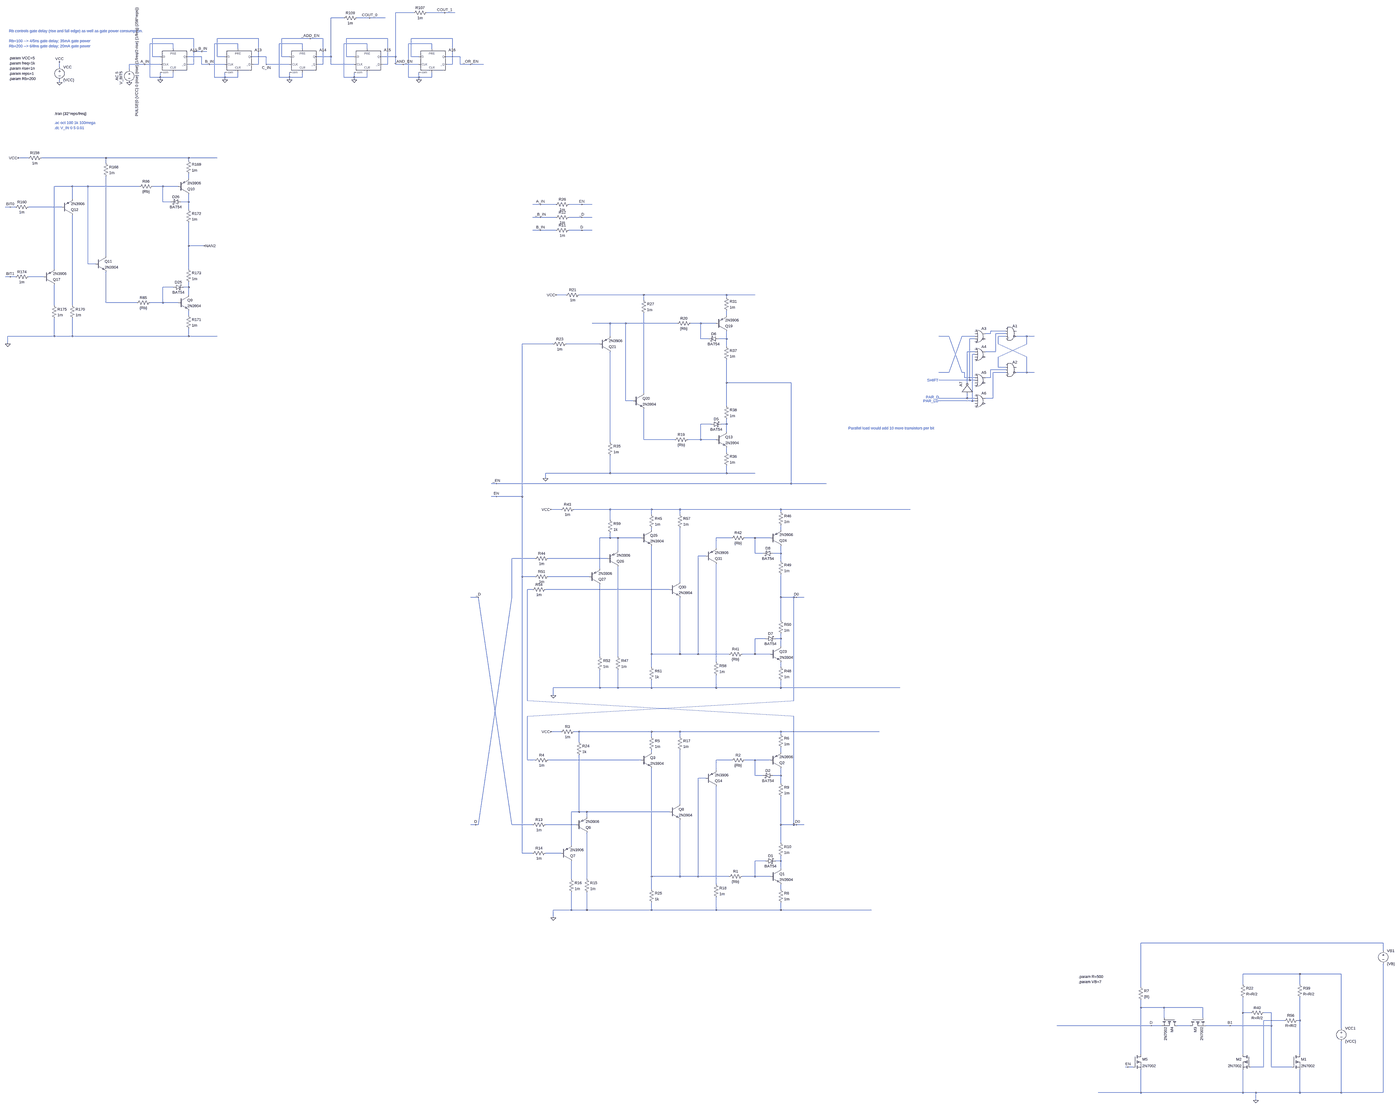
[diagram p0: schematic register_mos.asc, whole sheet]
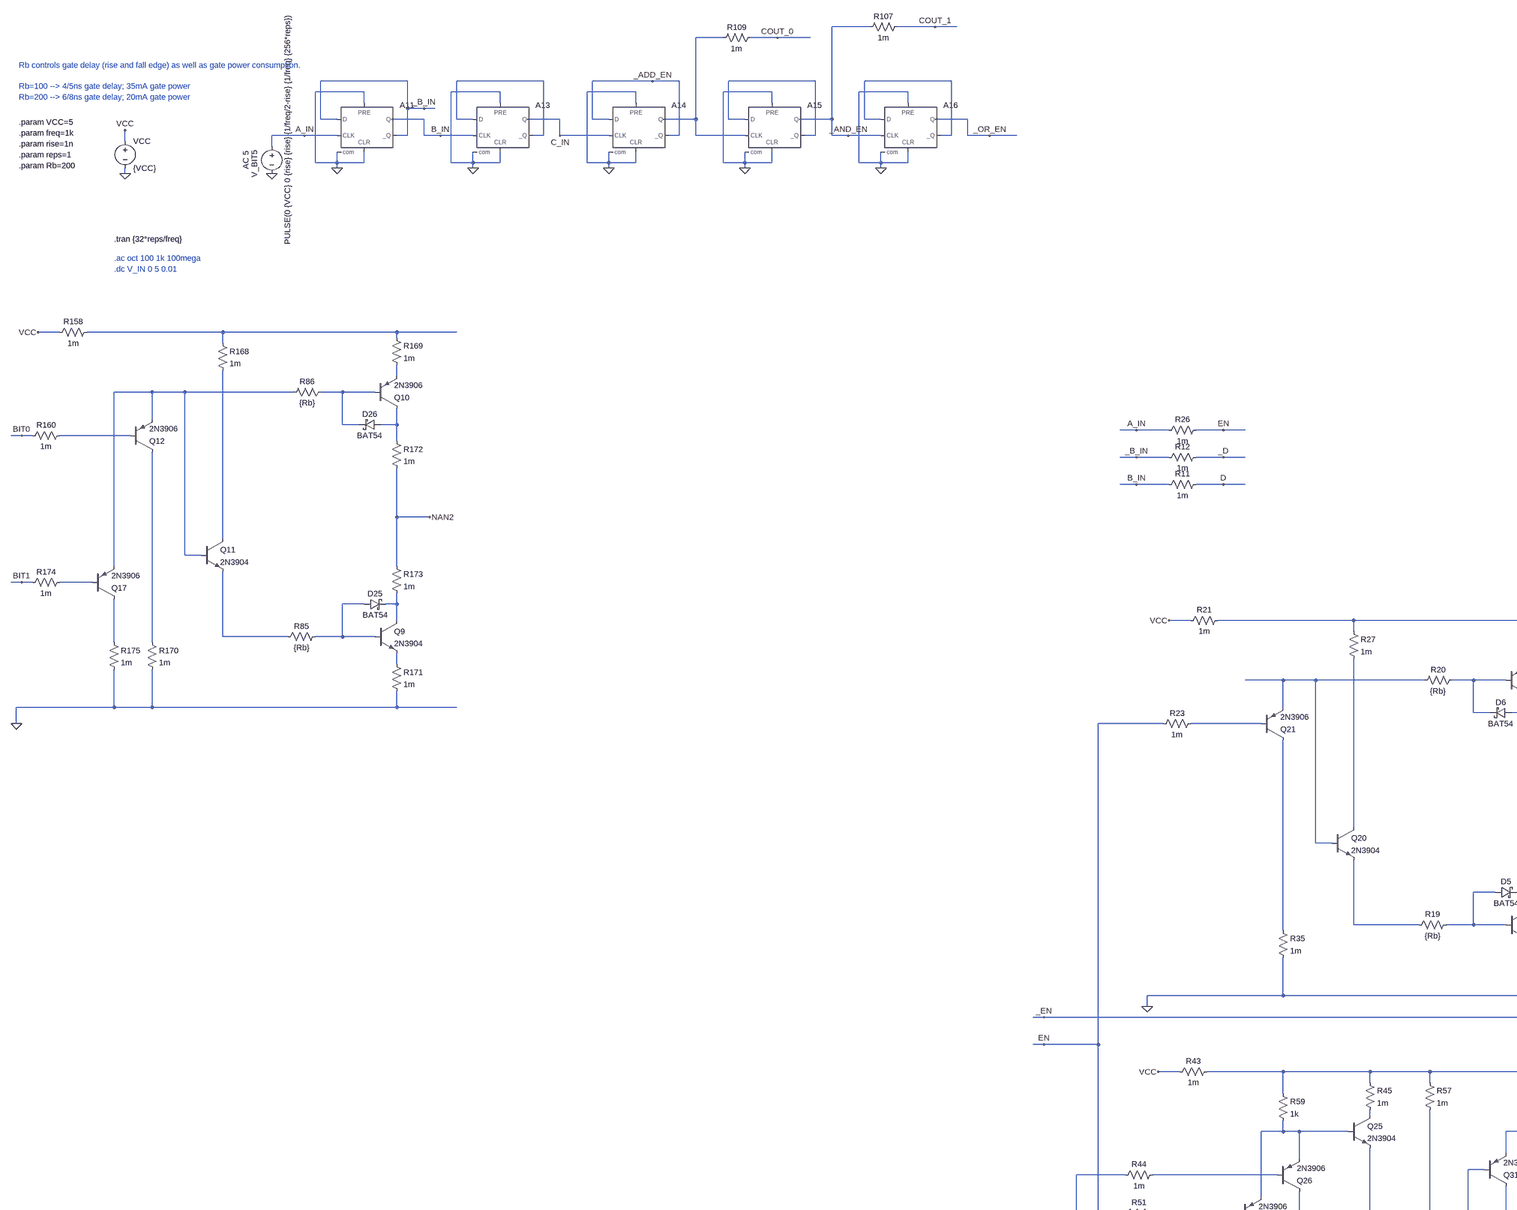
[diagram p1: schematic register_mos.asc, part, row 1 of 2, column 1 of 2]
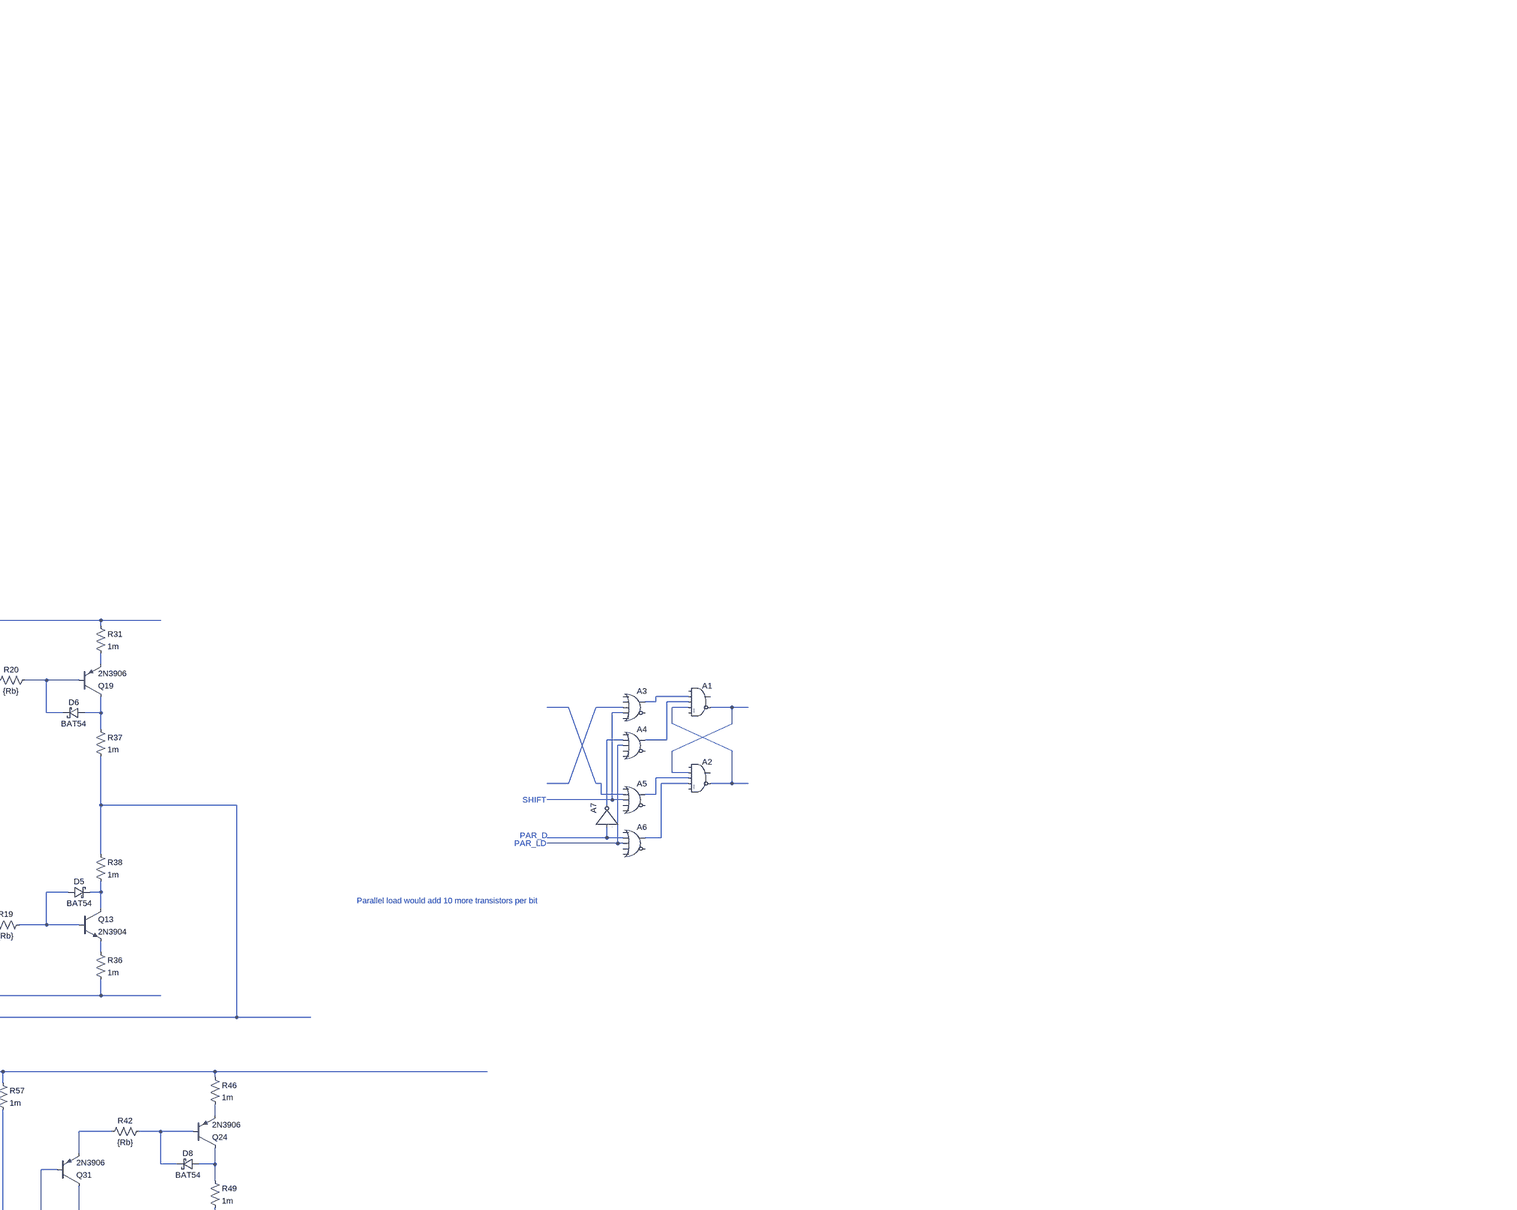
[diagram p2: schematic register_mos.asc, part, row 1 of 2, column 2 of 2]
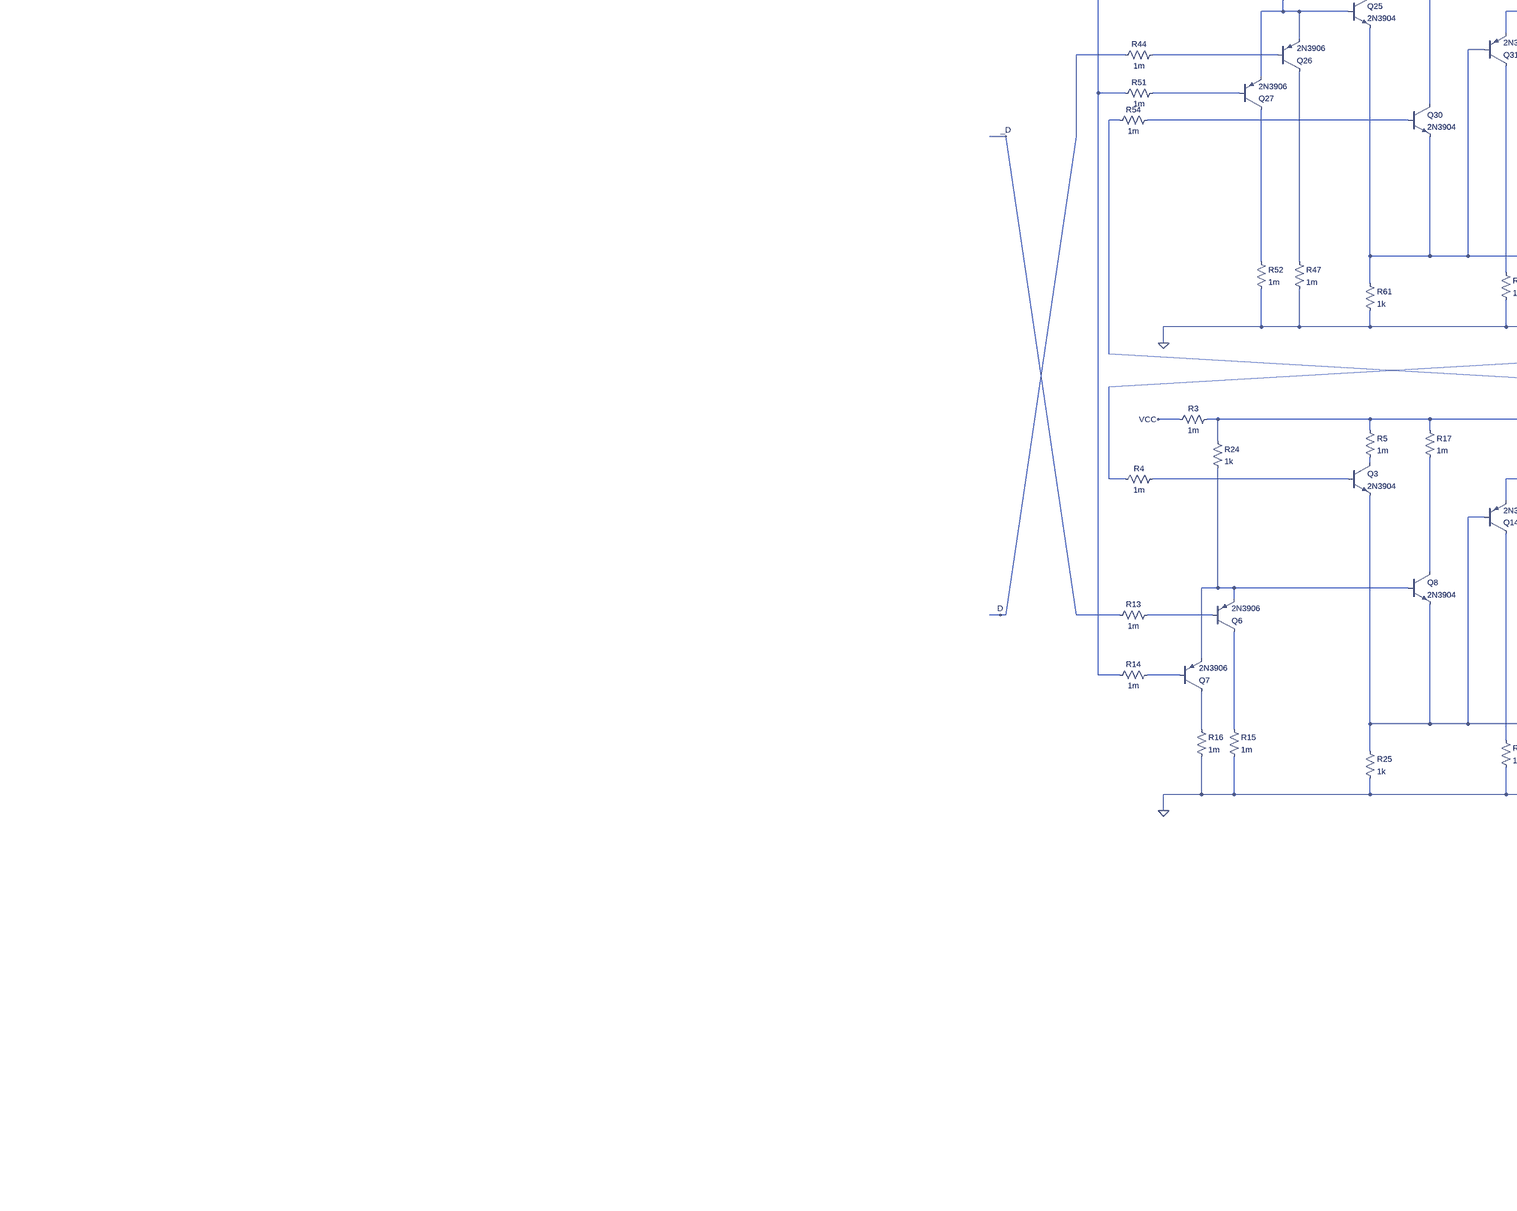
[diagram p3: schematic register_mos.asc, part, row 2 of 2, column 1 of 2]
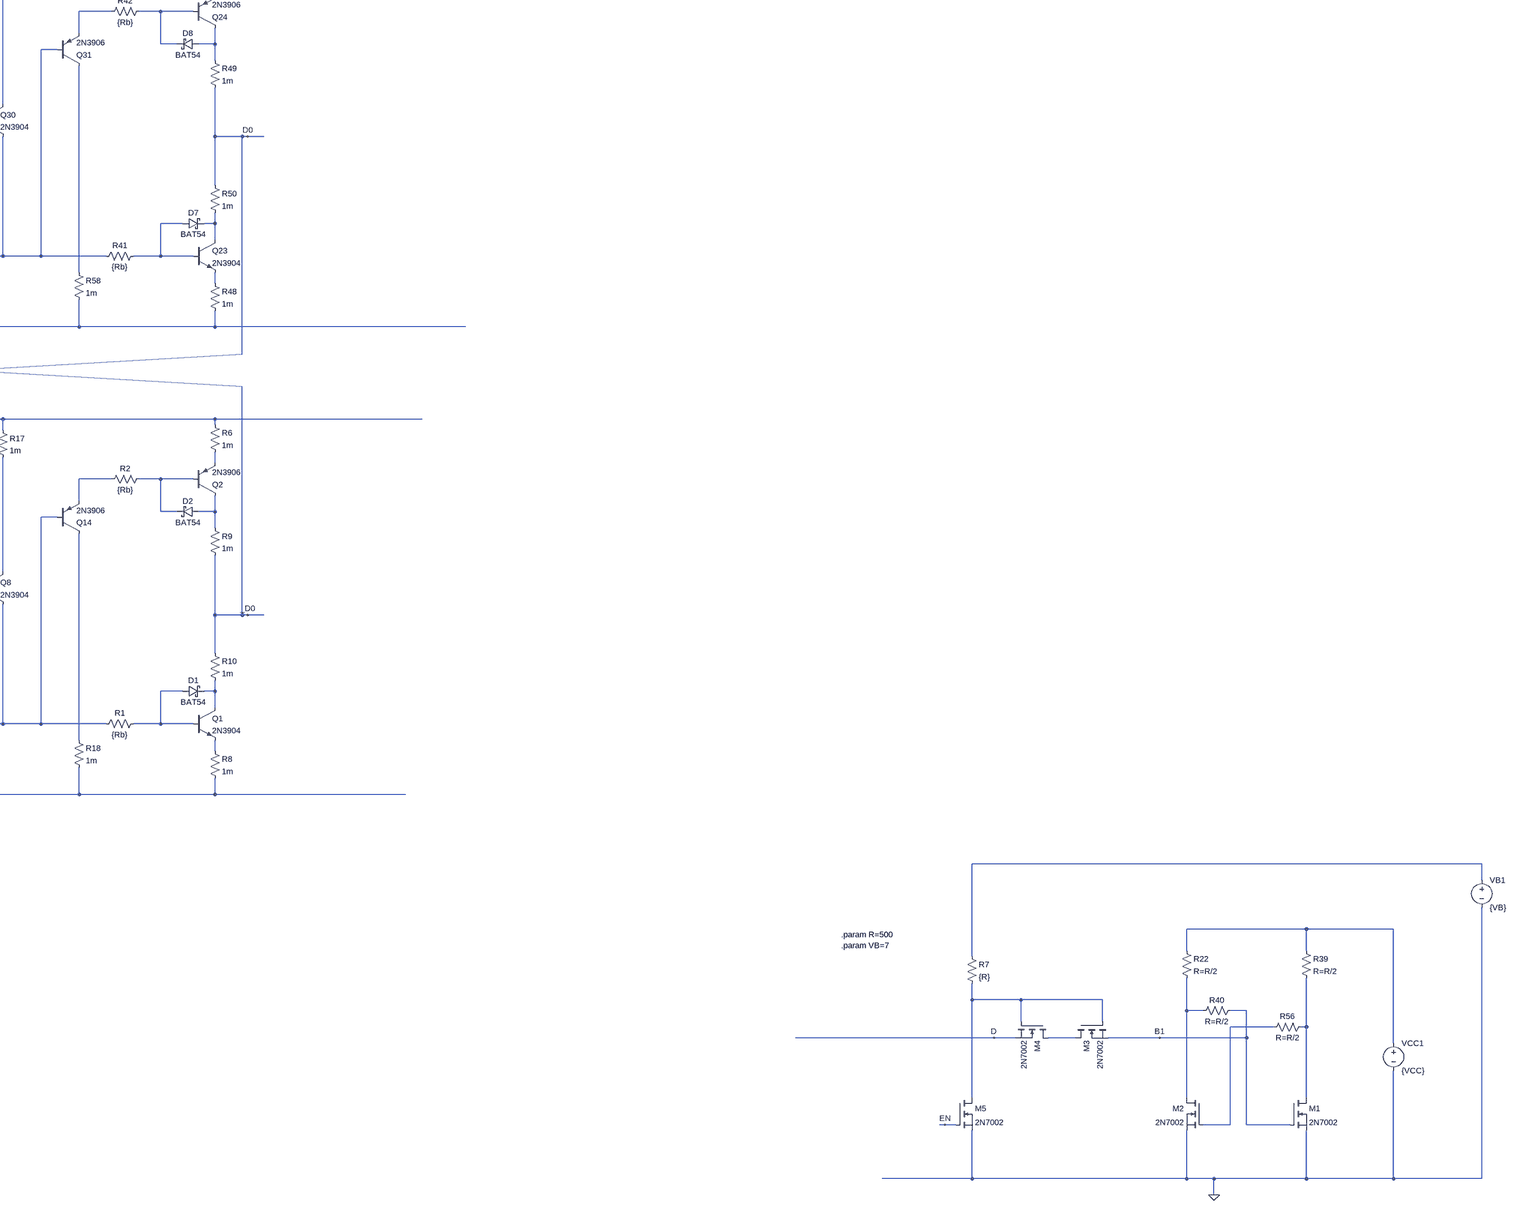
[diagram p4: schematic register_mos.asc, part, row 2 of 2, column 2 of 2]
register_mos.asc, the LTspice schematic file:
Version 4
SHEET 1 20052 9880
WIRE 1392 1344 1280 1344
WIRE 1584 1344 1472 1344
WIRE 1648 1344 1584 1344
WIRE 960 1376 880 1376
WIRE 1120 1376 1040 1376
WIRE 1216 1376 1120 1376
WIRE 32 1504 -224 1504
WIRE 432 1504 176 1504
WIRE 752 1504 576 1504
WIRE 832 1504 752 1504
WIRE 1232 1504 976 1504
WIRE 1632 1504 1376 1504
WIRE -96 1536 -240 1536
WIRE 304 1536 160 1536
WIRE 704 1536 560 1536
WIRE 1104 1536 960 1536
WIRE 1504 1536 1360 1536
WIRE -96 1568 -96 1536
WIRE 304 1568 304 1536
WIRE 704 1568 704 1536
WIRE 1104 1568 1104 1536
WIRE 1504 1568 1504 1536
WIRE 32 1584 32 1504
WIRE 80 1584 32 1584
WIRE 112 1584 80 1584
WIRE -224 1616 -224 1504
WIRE -176 1616 -224 1616
WIRE 80 1616 -16 1616
WIRE 176 1616 176 1504
WIRE 224 1616 176 1616
WIRE 480 1616 384 1616
WIRE 576 1616 576 1504
WIRE 624 1616 576 1616
WIRE 880 1616 880 1376
WIRE 880 1616 784 1616
WIRE 976 1616 976 1504
WIRE 1024 1616 976 1616
WIRE 1280 1616 1280 1344
WIRE 1280 1616 1184 1616
WIRE 1376 1616 1376 1504
WIRE 1424 1616 1376 1616
WIRE 1680 1616 1584 1616
WIRE -272 1664 -368 1664
WIRE -176 1664 -272 1664
WIRE 32 1664 32 1584
WIRE 32 1664 0 1664
WIRE 80 1664 80 1616
WIRE 128 1664 80 1664
WIRE 224 1664 128 1664
WIRE 432 1664 432 1504
WIRE 432 1664 400 1664
WIRE 480 1664 480 1616
WIRE 624 1664 480 1664
WIRE 832 1664 832 1504
WIRE 832 1664 800 1664
WIRE 880 1664 880 1616
WIRE 1024 1664 880 1664
WIRE 1232 1664 1232 1504
WIRE 1232 1664 1200 1664
WIRE 1280 1664 1280 1616
WIRE 1328 1664 1280 1664
WIRE 1424 1664 1328 1664
WIRE 1632 1664 1632 1504
WIRE 1632 1664 1600 1664
WIRE 1680 1664 1680 1616
WIRE 1744 1664 1680 1664
WIRE 1824 1664 1744 1664
WIRE -800 1680 -800 1648
WIRE -368 1696 -368 1664
WIRE -240 1744 -240 1536
WIRE -176 1744 -176 1712
WIRE -176 1744 -240 1744
WIRE -96 1744 -96 1712
WIRE -96 1744 -176 1744
WIRE 160 1744 160 1536
WIRE 224 1744 224 1712
WIRE 224 1744 160 1744
WIRE 304 1744 304 1712
WIRE 304 1744 224 1744
WIRE 560 1744 560 1536
WIRE 624 1744 624 1712
WIRE 624 1744 560 1744
WIRE 704 1744 704 1712
WIRE 704 1744 624 1744
WIRE 960 1744 960 1536
WIRE 1024 1744 1024 1712
WIRE 1024 1744 960 1744
WIRE 1104 1744 1104 1712
WIRE 1104 1744 1024 1744
WIRE 1360 1744 1360 1536
WIRE 1424 1744 1424 1712
WIRE 1424 1744 1360 1744
WIRE 1504 1744 1504 1712
WIRE 1504 1744 1424 1744
WIRE -176 1760 -176 1744
WIRE 224 1760 224 1744
WIRE 624 1760 624 1744
WIRE 1024 1760 1024 1744
WIRE 1424 1760 1424 1744
WIRE -800 1776 -800 1760
WIRE -992 2320 -1056 2320
WIRE -512 2320 -912 2320
WIRE 0 2320 -512 2320
WIRE 176 2320 0 2320
WIRE 0 2336 0 2320
WIRE -512 2352 -512 2320
WIRE 0 2448 0 2416
WIRE -720 2496 -832 2496
WIRE -624 2496 -720 2496
WIRE -304 2496 -624 2496
WIRE -160 2496 -224 2496
WIRE -64 2496 -160 2496
WIRE -720 2576 -720 2496
WIRE -160 2592 -160 2496
WIRE -112 2592 -160 2592
WIRE 0 2592 0 2544
WIRE 0 2592 -48 2592
WIRE 2176 2608 2128 2608
WIRE 2272 2608 2176 2608
WIRE 2432 2608 2352 2608
WIRE 2496 2608 2432 2608
WIRE -1104 2624 -1136 2624
WIRE -1072 2624 -1104 2624
WIRE -784 2624 -992 2624
WIRE 0 2640 0 2592
WIRE 2176 2688 2128 2688
WIRE 2272 2688 2176 2688
WIRE 2432 2688 2352 2688
WIRE 2496 2688 2432 2688
WIRE 2176 2768 2128 2768
WIRE 2272 2768 2176 2768
WIRE 2432 2768 2352 2768
WIRE 2496 2768 2432 2768
WIRE 0 2864 0 2720
WIRE 96 2864 0 2864
WIRE -512 2928 -512 2432
WIRE -624 2976 -624 2496
WIRE -576 2976 -624 2976
WIRE -832 3008 -832 2496
WIRE 0 3008 0 2864
WIRE -1104 3056 -1136 3056
WIRE -1072 3056 -1104 3056
WIRE -896 3056 -992 3056
WIRE -96 3120 -160 3120
WIRE 0 3120 0 3088
WIRE 0 3120 -32 3120
WIRE 0 3168 0 3120
WIRE 2336 3168 2272 3168
WIRE 2816 3168 2416 3168
WIRE 3328 3168 2816 3168
WIRE 3504 3168 3328 3168
WIRE 3328 3184 3328 3168
WIRE 2816 3200 2816 3168
WIRE -512 3216 -512 3024
WIRE -320 3216 -512 3216
WIRE -160 3216 -160 3120
WIRE -160 3216 -240 3216
WIRE -64 3216 -160 3216
WIRE -832 3232 -832 3104
WIRE -720 3232 -720 2672
WIRE 0 3296 0 3264
WIRE 3328 3296 3328 3264
WIRE 2608 3344 2496 3344
WIRE 2704 3344 2608 3344
WIRE 3024 3344 2704 3344
WIRE 3168 3344 3104 3344
WIRE 3264 3344 3168 3344
WIRE 5216 3392 5120 3392
WIRE 5120 3408 5120 3392
WIRE 5120 3408 5088 3408
WIRE 5216 3408 5152 3408
WIRE -832 3424 -832 3312
WIRE -832 3424 -1120 3424
WIRE -720 3424 -720 3312
WIRE -720 3424 -832 3424
WIRE 0 3424 0 3376
WIRE 0 3424 -720 3424
WIRE 176 3424 0 3424
WIRE 2608 3424 2608 3344
WIRE 4864 3424 4800 3424
WIRE 5024 3424 4944 3424
WIRE 5216 3424 5168 3424
WIRE 5344 3424 5280 3424
WIRE 5392 3424 5344 3424
WIRE 3168 3440 3168 3344
WIRE 3216 3440 3168 3440
WIRE 3328 3440 3328 3392
WIRE 3328 3440 3280 3440
WIRE 5024 3440 4992 3440
WIRE -1120 3472 -1120 3424
WIRE 2256 3472 2064 3472
WIRE 2544 3472 2336 3472
WIRE 5168 3472 5168 3424
WIRE 5344 3472 5344 3424
WIRE 3328 3488 3328 3440
WIRE 5024 3520 4976 3520
WIRE 5152 3520 5152 3408
WIRE 5152 3520 5088 3520
WIRE 5024 3536 5008 3536
WIRE 5168 3552 5344 3472
WIRE 5344 3552 5168 3472
WIRE 5168 3616 5168 3552
WIRE 5216 3616 5168 3616
WIRE 5216 3632 5120 3632
WIRE 4864 3648 4944 3424
WIRE 4864 3648 4800 3648
WIRE 4944 3648 4864 3424
WIRE 4960 3648 4944 3648
WIRE 5216 3648 5136 3648
WIRE 5344 3648 5344 3552
WIRE 5344 3648 5280 3648
WIRE 5392 3648 5344 3648
WIRE 4960 3680 4960 3648
WIRE 5024 3680 4960 3680
WIRE 5120 3680 5120 3632
WIRE 5120 3680 5088 3680
WIRE 4992 3696 4992 3440
WIRE 4992 3696 4800 3696
WIRE 5024 3696 4992 3696
WIRE 3328 3712 3328 3568
WIRE 3728 3712 3328 3712
WIRE 4976 3712 4976 3520
WIRE 2816 3776 2816 3280
WIRE 4976 3808 4976 3776
WIRE 4976 3808 4800 3808
WIRE 5024 3808 4976 3808
WIRE 5136 3808 5136 3648
WIRE 5136 3808 5088 3808
WIRE 2704 3824 2704 3344
WIRE 2752 3824 2704 3824
WIRE 5008 3824 5008 3536
WIRE 5008 3824 4800 3824
WIRE 5024 3824 5008 3824
WIRE 3328 3856 3328 3712
WIRE 3232 3968 3168 3968
WIRE 3328 3968 3328 3936
WIRE 3328 3968 3296 3968
WIRE 3328 4016 3328 3968
WIRE 2816 4064 2816 3872
WIRE 3008 4064 2816 4064
WIRE 3168 4064 3168 3968
WIRE 3168 4064 3088 4064
WIRE 3264 4064 3168 4064
WIRE 2608 4080 2608 3520
WIRE 3328 4144 3328 4112
WIRE 2608 4272 2608 4160
WIRE 2608 4272 2208 4272
WIRE 3328 4272 3328 4224
WIRE 3328 4272 2608 4272
WIRE 3504 4272 3328 4272
WIRE 2208 4304 2208 4272
WIRE 1904 4336 1872 4336
WIRE 3728 4336 3728 3712
WIRE 3728 4336 1904 4336
WIRE 4080 4336 3728 4336
WIRE 1904 4416 1872 4416
WIRE 2064 4416 2064 3472
WIRE 2064 4416 1904 4416
WIRE 2304 4496 2240 4496
WIRE 2608 4496 2384 4496
WIRE 2864 4496 2608 4496
WIRE 3040 4496 2864 4496
WIRE 3664 4496 3040 4496
WIRE 4624 4496 3664 4496
WIRE 3664 4512 3664 4496
WIRE 2864 4528 2864 4496
WIRE 3040 4528 3040 4496
WIRE 2608 4560 2608 4496
WIRE 2864 4624 2864 4608
WIRE 3664 4624 3664 4592
WIRE 2608 4672 2608 4640
WIRE 2608 4672 2544 4672
WIRE 2656 4672 2608 4672
WIRE 2800 4672 2656 4672
WIRE 3360 4672 3264 4672
WIRE 3504 4672 3440 4672
WIRE 3600 4672 3504 4672
WIRE 3264 4736 3264 4672
WIRE 2656 4752 2656 4672
WIRE 3504 4768 3504 4672
WIRE 3552 4768 3504 4768
WIRE 3664 4768 3664 4720
WIRE 3664 4768 3616 4768
WIRE 3200 4784 3152 4784
WIRE 2144 4800 2000 4800
WIRE 2592 4800 2224 4800
WIRE 3664 4816 3664 4768
WIRE 2544 4864 2544 4672
WIRE 2064 4912 2064 4416
WIRE 2144 4912 2064 4912
WIRE 2480 4912 2224 4912
WIRE 3040 4944 3040 4608
WIRE 2128 4992 2096 4992
WIRE 2976 4992 2208 4992
WIRE 1792 5040 1744 5040
WIRE 2000 5040 2000 4800
WIRE 3664 5040 3664 4896
WIRE 3744 5040 3664 5040
WIRE 3760 5040 3744 5040
WIRE 3808 5040 3760 5040
WIRE 3664 5184 3664 5040
WIRE 3568 5296 3504 5296
WIRE 3664 5296 3664 5264
WIRE 3664 5296 3632 5296
WIRE 3664 5344 3664 5296
WIRE 2864 5392 2864 4720
WIRE 3040 5392 3040 5040
WIRE 3040 5392 2864 5392
WIRE 3152 5392 3152 4784
WIRE 3152 5392 3040 5392
WIRE 3344 5392 3152 5392
WIRE 3504 5392 3504 5296
WIRE 3504 5392 3424 5392
WIRE 3600 5392 3504 5392
WIRE 2544 5408 2544 4960
WIRE 2656 5408 2656 4848
WIRE 3264 5440 3264 4832
WIRE 2864 5472 2864 5392
WIRE 3664 5472 3664 5440
WIRE 2544 5600 2544 5488
WIRE 2544 5600 2256 5600
WIRE 2656 5600 2656 5488
WIRE 2656 5600 2544 5600
WIRE 2864 5600 2864 5552
WIRE 2864 5600 2656 5600
WIRE 3264 5600 3264 5520
WIRE 3264 5600 2864 5600
WIRE 3664 5600 3664 5552
WIRE 3664 5600 3264 5600
WIRE 4560 5600 3664 5600
WIRE 2256 5648 2256 5600
WIRE 2096 5680 2096 4992
WIRE 3744 5680 3744 5040
WIRE 2096 5776 3744 5680
WIRE 3744 5776 2096 5680
WIRE 2304 5872 2240 5872
WIRE 2416 5872 2384 5872
WIRE 2864 5872 2416 5872
WIRE 3040 5872 2864 5872
WIRE 3664 5872 3040 5872
WIRE 4432 5872 3664 5872
WIRE 3664 5888 3664 5872
WIRE 2864 5904 2864 5872
WIRE 3040 5904 3040 5872
WIRE 2416 5936 2416 5872
WIRE 2864 6000 2864 5984
WIRE 3664 6000 3664 5968
WIRE 2096 6048 2096 5776
WIRE 2144 6048 2096 6048
WIRE 2800 6048 2224 6048
WIRE 3360 6048 3264 6048
WIRE 3504 6048 3440 6048
WIRE 3600 6048 3504 6048
WIRE 3264 6112 3264 6048
WIRE 3504 6144 3504 6048
WIRE 3552 6144 3504 6144
WIRE 3664 6144 3664 6096
WIRE 3664 6144 3616 6144
WIRE 3200 6160 3152 6160
WIRE 3664 6192 3664 6144
WIRE 3040 6320 3040 5984
WIRE 2416 6368 2416 6016
WIRE 2416 6368 2368 6368
WIRE 2464 6368 2416 6368
WIRE 2976 6368 2464 6368
WIRE 2464 6400 2464 6368
WIRE 1776 6448 1744 6448
WIRE 1792 6448 2000 5040
WIRE 1792 6448 1776 6448
WIRE 2000 6448 1792 5040
WIRE 2128 6448 2000 6448
WIRE 2400 6448 2208 6448
WIRE 3664 6448 3664 6272
WIRE 3744 6448 3744 5776
WIRE 3744 6448 3664 6448
WIRE 3760 6448 3744 6448
WIRE 3808 6448 3760 6448
WIRE 3664 6560 3664 6448
WIRE 2368 6576 2368 6368
WIRE 2064 6624 2064 4912
WIRE 2128 6624 2064 6624
WIRE 2304 6624 2208 6624
WIRE 3568 6672 3504 6672
WIRE 3664 6672 3664 6640
WIRE 3664 6672 3632 6672
WIRE 3664 6720 3664 6672
WIRE 2864 6768 2864 6096
WIRE 3040 6768 3040 6416
WIRE 3040 6768 2864 6768
WIRE 3152 6768 3152 6160
WIRE 3152 6768 3040 6768
WIRE 3344 6768 3152 6768
WIRE 3504 6768 3504 6672
WIRE 3504 6768 3424 6768
WIRE 3600 6768 3504 6768
WIRE 2368 6784 2368 6672
WIRE 2464 6784 2464 6496
WIRE 3264 6816 3264 6208
WIRE 2864 6848 2864 6768
WIRE 3664 6848 3664 6816
WIRE 2368 6976 2368 6864
WIRE 2368 6976 2256 6976
WIRE 2464 6976 2464 6864
WIRE 2464 6976 2368 6976
WIRE 2864 6976 2864 6928
WIRE 2864 6976 2464 6976
WIRE 3264 6976 3264 6896
WIRE 3264 6976 2864 6976
WIRE 3664 6976 3664 6928
WIRE 3664 6976 3264 6976
WIRE 4384 6976 3664 6976
WIRE 2256 7024 2256 6976
WIRE 7760 8784 6192 8784
WIRE 7760 8832 7760 8784
WIRE 7200 8976 6848 8976
WIRE 7456 8976 7200 8976
WIRE 6848 9040 6848 8976
WIRE 7200 9040 7200 8976
WIRE 6192 9056 6192 8784
WIRE 6192 9184 6192 9136
WIRE 6336 9184 6192 9184
WIRE 6576 9184 6336 9184
WIRE 6848 9216 6848 9120
WIRE 6896 9216 6848 9216
WIRE 7024 9216 6976 9216
WIRE 6336 9248 6336 9184
WIRE 6576 9248 6576 9184
WIRE 7104 9264 6976 9264
WIRE 7200 9264 7200 9120
WIRE 7200 9264 7184 9264
WIRE 6256 9296 5632 9296
WIRE 6320 9296 6256 9296
WIRE 6496 9296 6416 9296
WIRE 6768 9296 6592 9296
WIRE 7024 9296 7024 9216
WIRE 7024 9296 6768 9296
WIRE 7456 9312 7456 8976
WIRE 6192 9472 6192 9184
WIRE 6848 9472 6848 9216
WIRE 7200 9472 7200 9264
WIRE 6112 9552 6096 9552
WIRE 6144 9552 6112 9552
WIRE 6976 9552 6976 9264
WIRE 6976 9552 6896 9552
WIRE 7024 9552 7024 9296
WIRE 7152 9552 7024 9552
WIRE 6192 9792 6192 9568
WIRE 6192 9792 5920 9792
WIRE 6848 9792 6848 9568
WIRE 6848 9792 6192 9792
WIRE 6928 9792 6848 9792
WIRE 7200 9792 7200 9568
WIRE 7200 9792 6928 9792
WIRE 7456 9792 7456 9392
WIRE 7456 9792 7200 9792
WIRE 7760 9792 7760 8912
WIRE 7760 9792 7456 9792
WIRE 6928 9840 6928 9792
FLAG -800 1776 0
FLAG -800 1648 VCC
FLAG -1120 3472 0
FLAG 96 2864 NAN2
FLAG -1104 2624 BIT0
FLAG -1056 2320 VCC
FLAG -1104 3056 BIT1
FLAG -176 1760 0
FLAG -368 1776 0
FLAG -272 1664 A_IN
FLAG 128 1664 B_IN
FLAG 224 1760 0
FLAG 480 1664 C_IN
FLAG 624 1760 0
FLAG 752 1504 _ADD_EN
FLAG 1024 1760 0
FLAG 1328 1664 _AND_EN
FLAG 1424 1760 0
FLAG 1744 1664 _OR_EN
FLAG 1120 1376 COUT_0
FLAG 1584 1344 COUT_1
FLAG 2208 4304 0
FLAG 1904 4336 _EN
FLAG 1904 4416 EN
FLAG 2272 3168 VCC
FLAG 2256 5648 0
FLAG 3760 5040 D0
FLAG 2240 4496 VCC
FLAG 2256 7024 0
FLAG 3760 6448 _D0
FLAG 2240 5872 VCC
FLAG 1792 5040 _D
FLAG 1776 6448 D
FLAG 80 1584 _B_IN
FLAG 2432 2608 EN
FLAG 2432 2688 _D
FLAG 2432 2768 D
FLAG 2176 2608 A_IN
FLAG 2176 2688 _B_IN
FLAG 2176 2768 B_IN
FLAG 6928 9840 0
FLAG 6768 9296 B1
FLAG 6256 9296 D
FLAG 6112 9552 EN
SYMBOL voltage -800 1664 R0
WINDOW 123 0 0 Left 0
WINDOW 39 0 0 Left 0
SYMATTR InstName VCC
SYMATTR Value {VCC}
SYMBOL res -336 3232 R270
WINDOW 0 32 56 VTop 2
WINDOW 3 0 56 VBottom 2
SYMATTR InstName R85
SYMATTR Value {Rb}
SYMBOL npn -64 3168 R0
SYMATTR InstName Q9
SYMATTR Value 2N3904
SYMBOL schottky -96 3136 R270
WINDOW 0 32 32 VTop 2
WINDOW 3 0 32 VBottom 2
SYMATTR InstName D25
SYMATTR Value BAT54
SYMATTR Description Diode
SYMATTR Type diode
SYMBOL pnp -64 2544 M180
SYMATTR InstName Q10
SYMATTR Value 2N3906
SYMBOL schottky -48 2576 R90
WINDOW 0 0 32 VBottom 2
WINDOW 3 32 32 VTop 2
SYMATTR InstName D26
SYMATTR Value BAT54
SYMATTR Description Diode
SYMATTR Type diode
SYMBOL res -208 2480 R90
WINDOW 0 0 56 VBottom 2
WINDOW 3 32 56 VTop 2
SYMATTR InstName R86
SYMATTR Value {Rb}
SYMBOL res -1008 2336 R270
WINDOW 0 32 56 VTop 2
WINDOW 3 0 56 VBottom 2
SYMATTR InstName R158
SYMATTR Value 1m
SYMBOL res -1088 2640 R270
WINDOW 0 32 56 VTop 2
WINDOW 3 0 56 VBottom 2
SYMATTR InstName R160
SYMATTR Value 1m
SYMBOL npn -576 2928 R0
SYMATTR InstName Q11
SYMATTR Value 2N3904
SYMBOL pnp -784 2672 M180
SYMATTR InstName Q12
SYMATTR Value 2N3906
SYMBOL res -528 2336 R0
SYMATTR InstName R168
SYMATTR Value 1m
SYMBOL res -16 2320 R0
SYMATTR InstName R169
SYMATTR Value 1m
SYMBOL res -736 3216 R0
SYMATTR InstName R170
SYMATTR Value 1m
SYMBOL res -16 3280 R0
SYMATTR InstName R171
SYMATTR Value 1m
SYMBOL res -16 2624 R0
SYMATTR InstName R172
SYMATTR Value 1m
SYMBOL res -16 2992 R0
SYMATTR InstName R173
SYMATTR Value 1m
SYMBOL pnp -896 3104 M180
SYMATTR InstName Q17
SYMATTR Value 2N3906
SYMBOL res -1088 3072 R270
WINDOW 0 32 56 VTop 2
WINDOW 3 0 56 VBottom 2
SYMATTR InstName R174
SYMATTR Value 1m
SYMBOL res -848 3216 R0
SYMATTR InstName R175
SYMATTR Value 1m
SYMBOL voltage -368 1680 R0
WINDOW 123 -77 30 VRight 2
WINDOW 39 0 0 Left 0
WINDOW 0 -51 28 VRight 2
WINDOW 3 46 -379 VRight 2
SYMATTR Value2 AC 5
SYMATTR InstName V_BIT5
SYMATTR Value PULSE(0 {VCC} 0 {rise} {rise} {1/freq/2-rise} {1/freq} {256*reps})
SYMBOL Digital\\dflop -96 1568 R0
SYMATTR SpiceLine Vhigh={VCC}
SYMATTR InstName A11
SYMBOL Digital\\dflop 304 1568 R0
SYMATTR SpiceLine Vhigh={VCC}
SYMATTR InstName A13
SYMBOL Digital\\dflop 1104 1568 R0
SYMATTR SpiceLine Vhigh={VCC}
SYMATTR InstName A15
SYMBOL Digital\\dflop 1504 1568 R0
SYMATTR SpiceLine Vhigh={VCC}
SYMATTR InstName A16
SYMBOL Digital\\dflop 704 1568 R0
SYMATTR SpiceLine Vhigh={VCC}
SYMATTR InstName A14
SYMBOL res 1488 1328 R90
WINDOW 0 0 56 VBottom 2
WINDOW 3 32 56 VTop 2
SYMATTR InstName R107
SYMATTR Value 1m
SYMBOL res 1056 1360 R90
WINDOW 0 0 56 VBottom 2
WINDOW 3 32 56 VTop 2
SYMATTR InstName R109
SYMATTR Value 1m
SYMBOL res 2992 4080 R270
WINDOW 0 32 56 VTop 2
WINDOW 3 0 56 VBottom 2
SYMATTR InstName R19
SYMATTR Value {Rb}
SYMBOL npn 3264 4016 R0
SYMATTR InstName Q13
SYMATTR Value 2N3904
SYMBOL schottky 3232 3984 R270
WINDOW 0 32 32 VTop 2
WINDOW 3 0 32 VBottom 2
SYMATTR InstName D5
SYMATTR Value BAT54
SYMATTR Description Diode
SYMATTR Type diode
SYMBOL pnp 3264 3392 M180
SYMATTR InstName Q19
SYMATTR Value 2N3906
SYMBOL schottky 3280 3424 R90
WINDOW 0 0 32 VBottom 2
WINDOW 3 32 32 VTop 2
SYMATTR InstName D6
SYMATTR Value BAT54
SYMATTR Description Diode
SYMATTR Type diode
SYMBOL res 3120 3328 R90
WINDOW 0 0 56 VBottom 2
WINDOW 3 32 56 VTop 2
SYMATTR InstName R20
SYMATTR Value {Rb}
SYMBOL res 2320 3184 R270
WINDOW 0 32 56 VTop 2
WINDOW 3 0 56 VBottom 2
SYMATTR InstName R21
SYMATTR Value 1m
SYMBOL res 2240 3488 R270
WINDOW 0 32 56 VTop 2
WINDOW 3 0 56 VBottom 2
SYMATTR InstName R23
SYMATTR Value 1m
SYMBOL npn 2752 3776 R0
SYMATTR InstName Q20
SYMATTR Value 2N3904
SYMBOL pnp 2544 3520 M180
SYMATTR InstName Q21
SYMATTR Value 2N3906
SYMBOL res 2800 3184 R0
SYMATTR InstName R27
SYMATTR Value 1m
SYMBOL res 3312 3168 R0
SYMATTR InstName R31
SYMATTR Value 1m
SYMBOL res 2592 4064 R0
SYMATTR InstName R35
SYMATTR Value 1m
SYMBOL res 3312 4128 R0
SYMATTR InstName R36
SYMATTR Value 1m
SYMBOL res 3312 3472 R0
SYMATTR InstName R37
SYMATTR Value 1m
SYMBOL res 3312 3840 R0
SYMATTR InstName R38
SYMATTR Value 1m
SYMBOL res 3328 5408 R270
WINDOW 0 32 56 VTop 2
WINDOW 3 0 56 VBottom 2
SYMATTR InstName R41
SYMATTR Value {Rb}
SYMBOL npn 3600 5344 R0
SYMATTR InstName Q23
SYMATTR Value 2N3904
SYMBOL schottky 3568 5312 R270
WINDOW 0 32 32 VTop 2
WINDOW 3 0 32 VBottom 2
SYMATTR InstName D7
SYMATTR Value BAT54
SYMATTR Description Diode
SYMATTR Type diode
SYMBOL pnp 3600 4720 M180
SYMATTR InstName Q24
SYMATTR Value 2N3906
SYMBOL schottky 3616 4752 R90
WINDOW 0 0 32 VBottom 2
WINDOW 3 32 32 VTop 2
SYMATTR InstName D8
SYMATTR Value BAT54
SYMATTR Description Diode
SYMATTR Type diode
SYMBOL res 3456 4656 R90
WINDOW 0 0 56 VBottom 2
WINDOW 3 32 56 VTop 2
SYMATTR InstName R42
SYMATTR Value {Rb}
SYMBOL res 2288 4512 R270
WINDOW 0 32 56 VTop 2
WINDOW 3 0 56 VBottom 2
SYMATTR InstName R43
SYMATTR Value 1m
SYMBOL res 2128 4816 R270
WINDOW 0 32 56 VTop 2
WINDOW 3 0 56 VBottom 2
SYMATTR InstName R44
SYMATTR Value 1m
SYMBOL npn 2800 4624 R0
SYMATTR InstName Q25
SYMATTR Value 2N3904
SYMBOL pnp 2592 4848 M180
SYMATTR InstName Q26
SYMATTR Value 2N3906
SYMBOL res 2848 4512 R0
SYMATTR InstName R45
SYMATTR Value 1m
SYMBOL res 3648 4496 R0
SYMATTR InstName R46
SYMATTR Value 1m
SYMBOL res 2640 5392 R0
SYMATTR InstName R47
SYMATTR Value 1m
SYMBOL res 3648 5456 R0
SYMATTR InstName R48
SYMATTR Value 1m
SYMBOL res 3648 4800 R0
SYMATTR InstName R49
SYMATTR Value 1m
SYMBOL res 3648 5168 R0
SYMATTR InstName R50
SYMATTR Value 1m
SYMBOL pnp 2480 4960 M180
SYMATTR InstName Q27
SYMATTR Value 2N3906
SYMBOL res 2128 4928 R270
WINDOW 0 32 56 VTop 2
WINDOW 3 0 56 VBottom 2
SYMATTR InstName R51
SYMATTR Value 1m
SYMBOL res 2528 5392 R0
SYMATTR InstName R52
SYMATTR Value 1m
SYMBOL res 2112 5008 R270
WINDOW 0 32 56 VTop 2
WINDOW 3 0 56 VBottom 2
SYMATTR InstName R54
SYMATTR Value 1m
SYMBOL res 3024 4512 R0
SYMATTR InstName R57
SYMATTR Value 1m
SYMBOL npn 2976 4944 R0
SYMATTR InstName Q30
SYMATTR Value 2N3904
SYMBOL pnp 3200 4832 M180
SYMATTR InstName Q31
SYMATTR Value 2N3906
SYMBOL res 3248 5424 R0
SYMATTR InstName R58
SYMATTR Value 1m
SYMBOL res 2592 4544 R0
SYMATTR InstName R59
SYMATTR Value 1k
SYMBOL res 2848 5456 R0
SYMATTR InstName R61
SYMATTR Value 1k
SYMBOL res 3328 6784 R270
WINDOW 0 32 56 VTop 2
WINDOW 3 0 56 VBottom 2
SYMATTR InstName R1
SYMATTR Value {Rb}
SYMBOL npn 3600 6720 R0
SYMATTR InstName Q1
SYMATTR Value 2N3904
SYMBOL schottky 3568 6688 R270
WINDOW 0 32 32 VTop 2
WINDOW 3 0 32 VBottom 2
SYMATTR InstName D1
SYMATTR Value BAT54
SYMATTR Description Diode
SYMATTR Type diode
SYMBOL pnp 3600 6096 M180
SYMATTR InstName Q2
SYMATTR Value 2N3906
SYMBOL schottky 3616 6128 R90
WINDOW 0 0 32 VBottom 2
WINDOW 3 32 32 VTop 2
SYMATTR InstName D2
SYMATTR Value BAT54
SYMATTR Description Diode
SYMATTR Type diode
SYMBOL res 3456 6032 R90
WINDOW 0 0 56 VBottom 2
WINDOW 3 32 56 VTop 2
SYMATTR InstName R2
SYMATTR Value {Rb}
SYMBOL res 2288 5888 R270
WINDOW 0 32 56 VTop 2
WINDOW 3 0 56 VBottom 2
SYMATTR InstName R3
SYMATTR Value 1m
SYMBOL res 2128 6064 R270
WINDOW 0 32 56 VTop 2
WINDOW 3 0 56 VBottom 2
SYMATTR InstName R4
SYMATTR Value 1m
SYMBOL npn 2800 6000 R0
SYMATTR InstName Q3
SYMATTR Value 2N3904
SYMBOL res 2848 5888 R0
SYMATTR InstName R5
SYMATTR Value 1m
SYMBOL res 3648 5872 R0
SYMATTR InstName R6
SYMATTR Value 1m
SYMBOL res 3648 6832 R0
SYMATTR InstName R8
SYMATTR Value 1m
SYMBOL res 3648 6176 R0
SYMATTR InstName R9
SYMATTR Value 1m
SYMBOL res 3648 6544 R0
SYMATTR InstName R10
SYMATTR Value 1m
SYMBOL pnp 2400 6496 M180
SYMATTR InstName Q6
SYMATTR Value 2N3906
SYMBOL res 2112 6464 R270
WINDOW 0 32 56 VTop 2
WINDOW 3 0 56 VBottom 2
SYMATTR InstName R13
SYMATTR Value 1m
SYMBOL pnp 2304 6672 M180
SYMATTR InstName Q7
SYMATTR Value 2N3906
SYMBOL res 2112 6640 R270
WINDOW 0 32 56 VTop 2
WINDOW 3 0 56 VBottom 2
SYMATTR InstName R14
SYMATTR Value 1m
SYMBOL res 2448 6768 R0
SYMATTR InstName R15
SYMATTR Value 1m
SYMBOL res 2352 6768 R0
SYMATTR InstName R16
SYMATTR Value 1m
SYMBOL res 3024 5888 R0
SYMATTR InstName R17
SYMATTR Value 1m
SYMBOL npn 2976 6320 R0
SYMATTR InstName Q8
SYMATTR Value 2N3904
SYMBOL pnp 3200 6208 M180
SYMATTR InstName Q14
SYMATTR Value 2N3906
SYMBOL res 3248 6800 R0
SYMATTR InstName R18
SYMATTR Value 1m
SYMBOL res 2400 5920 R0
SYMATTR InstName R24
SYMATTR Value 1k
SYMBOL res 2848 6832 R0
SYMATTR InstName R25
SYMATTR Value 1k
SYMBOL res 2256 2784 R270
WINDOW 0 32 56 VTop 2
WINDOW 3 0 56 VBottom 2
SYMATTR InstName R11
SYMATTR Value 1m
SYMBOL res 2256 2704 R270
WINDOW 0 32 56 VTop 2
WINDOW 3 0 56 VBottom 2
SYMATTR InstName R12
SYMATTR Value 1m
SYMBOL res 2256 2624 R270
WINDOW 0 32 56 VTop 2
WINDOW 3 0 56 VBottom 2
SYMATTR InstName R26
SYMATTR Value 1m
SYMBOL Digital\\and 5248 3344 R0
SYMATTR InstName A1
SYMBOL Digital\\and 5248 3568 R0
SYMATTR InstName A2
SYMBOL Digital\\or 5056 3360 R0
SYMATTR InstName A3
SYMBOL Digital\\or 5056 3472 R0
SYMATTR InstName A4
SYMBOL Digital\\or 5056 3632 R0
SYMATTR InstName A5
SYMBOL Digital\\or 5056 3760 R0
SYMATTR InstName A6
SYMBOL Digital\\inv 4912 3776 R270
SYMATTR InstName A7
SYMBOL nmos 7152 9472 R0
SYMATTR InstName M1
SYMATTR Value 2N7002
SYMBOL nmos 6896 9472 M0
SYMATTR InstName M2
SYMATTR Value 2N7002
SYMBOL nmos 6496 9248 M90
SYMATTR InstName M3
SYMATTR Value 2N7002
SYMBOL nmos 6416 9248 R90
SYMATTR InstName M4
SYMATTR Value 2N7002
SYMBOL nmos 6144 9472 R0
SYMATTR InstName M5
SYMATTR Value 2N7002
SYMBOL res 6176 9040 R0
SYMATTR InstName R7
SYMATTR Value {R}
SYMBOL res 6832 9024 R0
SYMATTR InstName R22
SYMATTR Value R=R/2
SYMBOL res 7184 9024 R0
SYMATTR InstName R39
SYMATTR Value R=R/2
SYMBOL voltage 7760 8816 R0
WINDOW 123 0 0 Left 0
WINDOW 39 0 0 Left 0
SYMATTR InstName VB1
SYMATTR Value {VB}
SYMBOL voltage 7456 9296 R0
SYMATTR InstName VCC1
SYMATTR Value {VCC}
SYMBOL res 6992 9200 R90
WINDOW 0 0 56 VBottom 2
WINDOW 3 32 56 VTop 2
SYMATTR InstName R40
SYMATTR Value R=R/2
SYMBOL res 7200 9248 R90
WINDOW 0 0 56 VBottom 2
WINDOW 3 32 56 VTop 2
SYMATTR InstName R56
SYMATTR Value R=R/2
TEXT -832 1968 Left 2 !.tran {32*reps/freq}
TEXT -832 2024 Left 2 ;.ac oct 100 1k 100mega
TEXT -832 2056 Left 2 ;.dc V_IN 0 5 0.01
TEXT -1112 1624 Left 2 !.param VCC=5
TEXT -1112 1656 Left 2 !.param freq=1k
TEXT -1112 1688 Left 2 !.param rise=1n
TEXT -1112 1720 Left 2 !.param reps=1
TEXT -1112 1752 Left 2 !.param Rb=200
TEXT -1112 1456 Left 2 ;Rb controls gate delay (rise and fall edge) as well as gate power consumption.\n \nRb=100 --> 4/5ns gate delay; 35mA gate power\nRb=200 --> 6/8ns gate delay; 20mA gate power
TEXT 4240 3992 Left 2 ;Parallel load would add 10 more transistors per bit
TEXT 4704 3824 Left 2 ;PAR_LD
TEXT 4720 3800 Left 2 ;PAR_D
TEXT 4728 3696 Left 2 ;SHIFT
TEXT 5800 8992 Left 2 !.param R=500
TEXT 5800 9024 Left 2 !.param VB=7

The netlist it stands for:
* register_mos.asc
VCC VCC 0 {VCC}
R85 N016 N013 {Rb}
Q9 N014 N013 N019 0 2N3904
D25 N013 N014 BAT54
Q10 N009 N008 N006 0 2N3906
D26 N009 N008 BAT54
R86 N008 N007 {Rb}
R158 VCC N005 1m
R160 BIT0 N010 1m
Q11 N011 N007 N016 0 2N3904
Q12 N018 N010 N007 0 2N3906
R168 N005 N011 1m
R169 N005 N006 1m
R170 N018 0 1m
R171 N019 0 1m
R172 N009 NAN2 1m
R173 NAN2 N014 1m
Q17 N017 N012 N007 0 2N3906
R174 BIT1 N012 1m
R175 N017 0 1m
V_BIT5 A_IN 0 PULSE(0 {VCC} 0 {rise} {rise} {1/freq/2-rise} {1/freq} {256*reps}) AC 5
A11 _B_IN 0 A_IN 0 0 _B_IN B_IN 0 DFLOP Vhigh={VCC}
A13 N002 0 B_IN 0 0 N002 C_IN 0 DFLOP Vhigh={VCC}
A15 N003 0 N001 0 0 N003 _AND_EN 0 DFLOP Vhigh={VCC}
A16 N004 0 _AND_EN 0 0 N004 _OR_EN 0 DFLOP Vhigh={VCC}
A14 _ADD_EN 0 C_IN 0 0 _ADD_EN N001 0 DFLOP Vhigh={VCC}
R107 COUT_1 _AND_EN 1m
R109 COUT_0 N001 1m
R19 N040 N038 {Rb}
Q13 N039 N038 N042 0 2N3904
D5 N038 N039 BAT54
Q19 N029 N022 N020 0 2N3906
D6 N029 N022 BAT54
R20 N022 N021 {Rb}
R21 VCC N015 1m
R23 EN N031 1m
Q20 N036 N021 N040 0 2N3904
Q21 N041 N031 N021 0 2N3906
R27 N015 N036 1m
R31 N015 N020 1m
R35 N041 0 1m
R36 N042 0 1m
R37 N029 _EN 1m
R38 _EN N039 1m
R41 N050 N055 {Rb}
Q23 N056 N055 N060 0 2N3904
D7 N055 N056 BAT54
Q24 N049 N048 N045 0 2N3906
D8 N049 N048 BAT54
R42 N048 N047 {Rb}
R43 VCC N043 1m
R44 D N051 1m
Q25 N044 N046 N050 0 2N3904
Q26 N058 N051 N046 0 2N3906
R45 N043 N044 1m
R46 N043 N045 1m
R47 N058 0 1m
R48 N060 0 1m
R49 N049 D0 1m
R50 D0 N056 1m
Q27 N057 N052 N046 0 2N3906
R51 EN N052 1m
R52 N057 0 1m
R54 _D0 N054 1m
R57 N043 N053 1m
Q30 N053 N054 N050 0 2N3904
Q31 N059 N050 N047 0 2N3906
R58 N059 0 1m
R59 N043 N046 1k
R61 N050 0 1k
R1 N068 N073 {Rb}
Q1 N074 N073 N078 0 2N3904
D1 N073 N074 BAT54
Q2 N067 N066 N063 0 2N3906
D2 N067 N066 BAT54
R2 N066 N065 {Rb}
R3 VCC N061 1m
R4 D0 N064 1m
Q3 N062 N064 N068 0 2N3904
R5 N061 N062 1m
R6 N061 N063 1m
R8 N078 0 1m
R9 N067 _D0 1m
R10 _D0 N074 1m
Q6 N076 N071 N070 0 2N3906
R13 _D N071 1m
Q7 N075 N072 N070 0 2N3906
R14 EN N072 1m
R15 N076 0 1m
R16 N075 0 1m
R17 N061 N069 1m
Q8 N069 N070 N068 0 2N3904
Q14 N077 N068 N065 0 2N3906
R18 N077 0 1m
R24 N061 N070 1k
R25 N068 0 1k
R11 B_IN D 1m
R12 _B_IN _D 1m
R26 A_IN EN 1m
A1 0 N023 N024 N027 0 N028 0 0 AND
A2 0 N028 N034 N035 0 N027 0 0 AND
A3 0 0 N026 N030 0 0 N023 0 OR
A4 0 N032 N033 0 0 0 N024 0 OR
A5 0 N025 N030 0 0 0 N034 0 OR
A6 0 N037 N033 0 0 0 N035 0 OR
A7 N037 0 0 0 0 N032 0 0 BUF
M1 N084 B1 0 0 2N7002
M2 N082 N083 0 0 2N7002
M3 N085 N081 B1 B1 2N7002
M4 N085 N081 D D 2N7002
M5 N081 EN 0 0 2N7002
R7 N079 N081 {R}
R22 N080 N082 R=R/2
R39 N080 N084 R=R/2
VB1 N079 0 {VB}
VCC1 N080 0 {VCC}
R40 B1 N082 R=R/2
R56 N084 N083 R=R/2
.model D D
.lib standard.dio
.model NPN NPN
.model PNP PNP
.lib standard.bjt
.model NMOS NMOS
.model PMOS PMOS
.lib standard.mos
.tran {32*reps/freq}
* .ac oct 100 1k 100mega
* .dc V_IN 0 5 0.01
.param VCC=5
.param freq=1k
.param rise=1n
.param reps=1
.param Rb=200
* Rb controls gate delay (rise and fall edge) as well as gate power consumption.
* Rb=100 --> 4/5ns gate delay; 35mA gate power
* Rb=200 --> 6/8ns gate delay; 20mA gate power
* Parallel load would add 10 more transistors per bit
* PAR_LD
* PAR_D
* SHIFT
.param R=500
.param VB=7
.backanno
.end